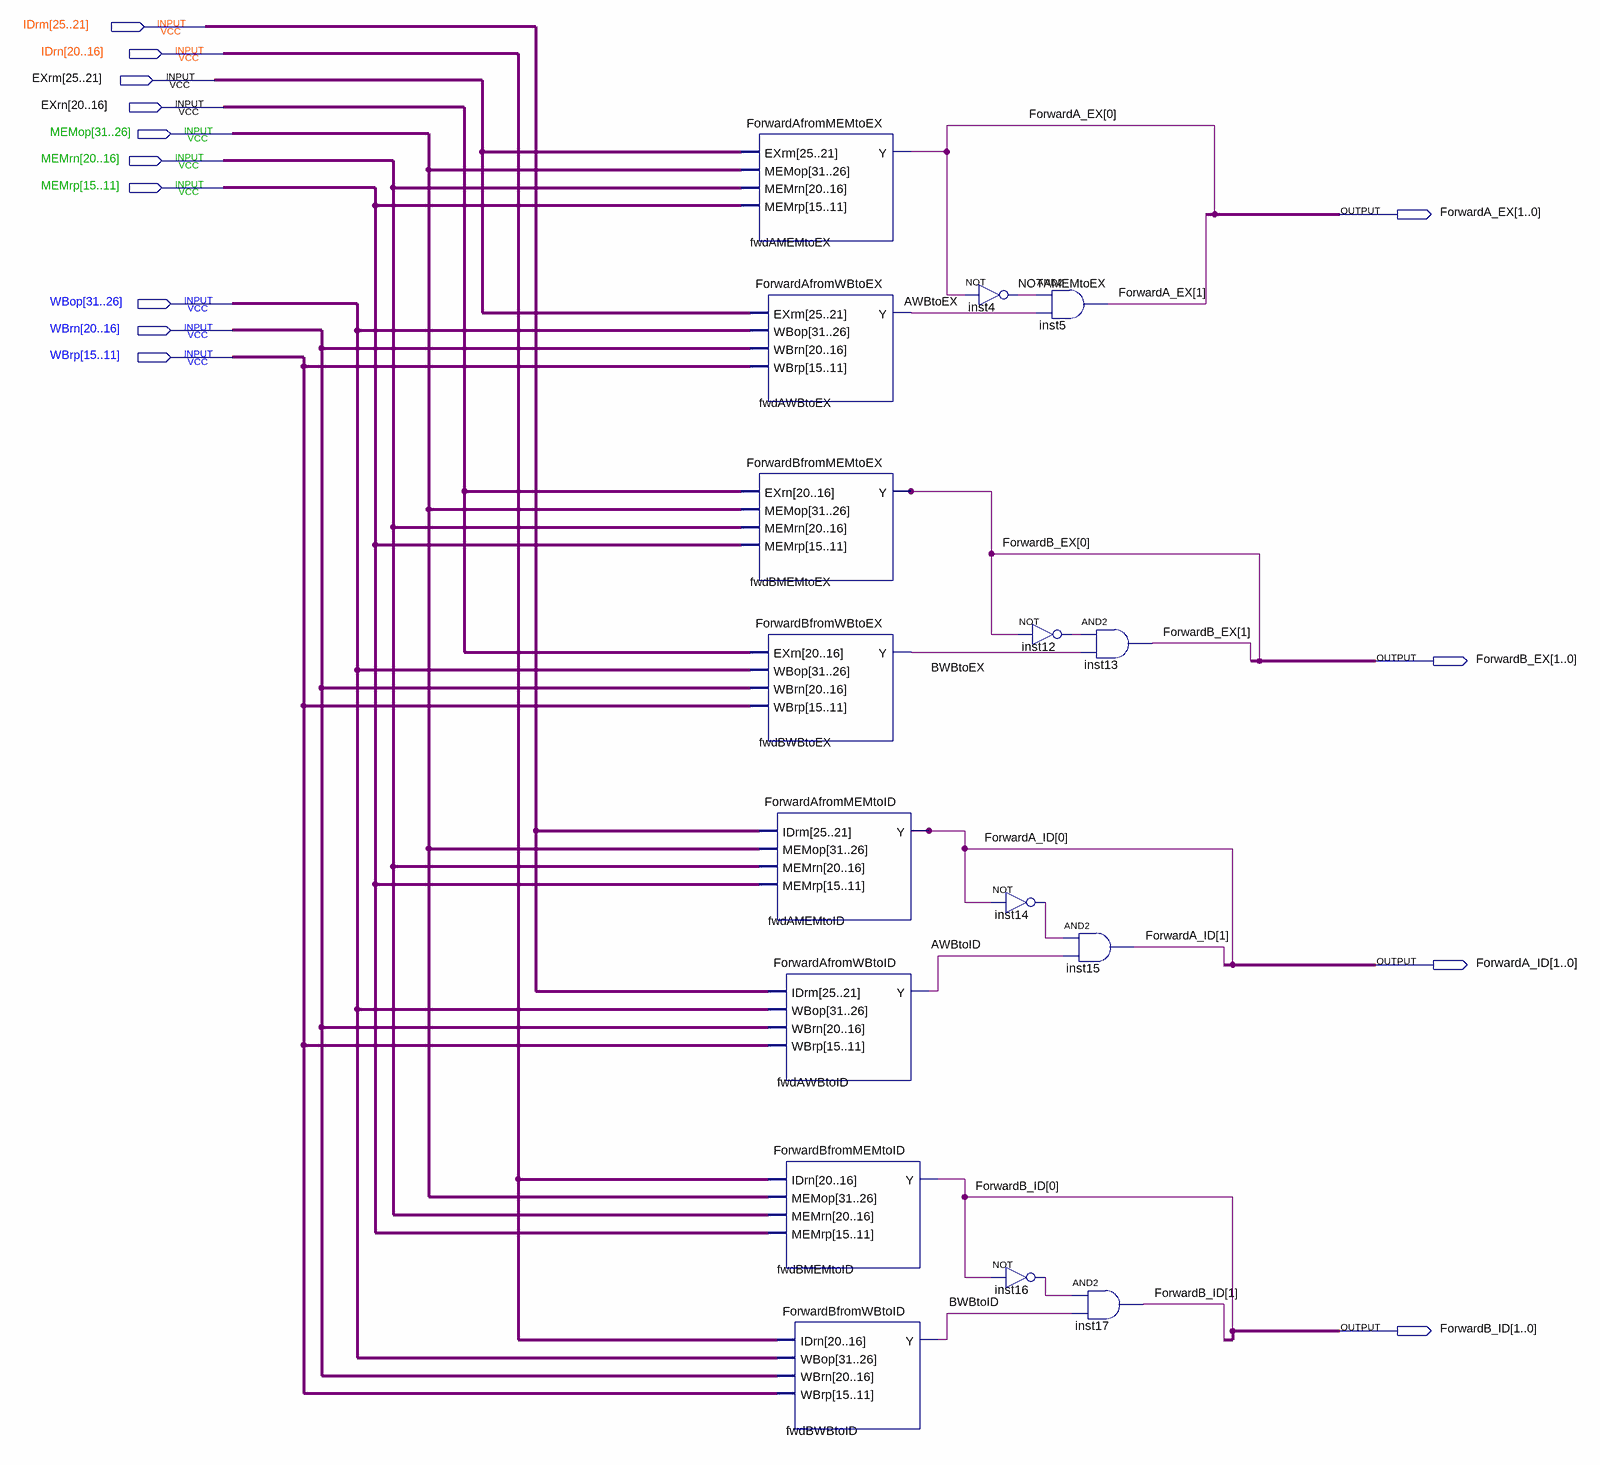
[diagram p0: schematic sheet]
// Quartus schematic ForwardDetection.bdf as structural Verilog: 16 symbols, 14 pins
module ForwardDetection (
  input  [25:21] IDrm,
  input  [20:16] IDrn,
  input  [25:21] EXrm,
  input  [20:16] EXrn,
  input  [31:26] MEMop,
  input  [20:16] MEMrn,
  input  [15:11] MEMrp,
  input  [31:26] WBop,
  input  [20:16] WBrn,
  input  [15:11] WBrp,
  output [1:0] ForwardA_EX,
  output [1:0] ForwardB_EX,
  output [1:0] ForwardA_ID,
  output [1:0] ForwardB_ID
);

  wire AWBtoEX, AWBtoID, BWBtoEX, BWBtoID, inst12_out, inst14_out, inst16_out, NOTAMEMtoEX;

  ForwardAfromMEMtoEX fwdAMEMtoEX (.EXrm(EXrm), .MEMop(MEMop), .MEMrn(MEMrn), .MEMrp(MEMrp), .Y(ForwardA_EX[0]));
  ForwardAfromWBtoEX fwdAWBtoEX (.EXrm(EXrm), .WBop(WBop), .WBrn(WBrn), .WBrp(WBrp), .Y(AWBtoEX));
  ForwardBfromMEMtoEX fwdBMEMtoEX (.EXrn(EXrn), .MEMop(MEMop), .MEMrn(MEMrn), .MEMrp(MEMrp), .Y(ForwardB_EX[0]));
  ForwardBfromWBtoEX fwdBWBtoEX (.EXrn(EXrn), .WBop(WBop), .WBrn(WBrn), .WBrp(WBrp), .Y(BWBtoEX));
  ForwardAfromMEMtoID fwdAMEMtoID (.IDrm(IDrm), .MEMop(MEMop), .MEMrn(MEMrn), .MEMrp(MEMrp), .Y(ForwardA_ID[0]));
  ForwardAfromWBtoID fwdAWBtoID (.IDrm(IDrm), .WBop(WBop), .WBrn(WBrn), .WBrp(WBrp), .Y(AWBtoID));
  ForwardBfromMEMtoID fwdBMEMtoID (.IDrn(IDrn), .MEMop(MEMop), .MEMrn(MEMrn), .MEMrp(MEMrp), .Y(ForwardB_ID[0]));
  ForwardBfromWBtoID fwdBWBtoID (.IDrn(IDrn), .WBop(WBop), .WBrn(WBrn), .WBrp(WBrp), .Y(BWBtoID));
  not inst4 (NOTAMEMtoEX, ForwardA_EX[0]);
  and inst5 (ForwardA_EX[1], NOTAMEMtoEX, AWBtoEX);
  not inst12 (inst12_out, ForwardB_EX[0]);
  not inst14 (inst14_out, ForwardA_ID[0]);
  not inst16 (inst16_out, ForwardB_ID[0]);
  and inst13 (ForwardB_EX[1], inst12_out, BWBtoEX);
  and inst15 (ForwardA_ID[1], inst14_out, AWBtoID);
  and inst17 (ForwardB_ID[1], inst16_out, BWBtoID);
endmodule
